# Altium schematic sheet HPS_IOs.SchDoc
size A1
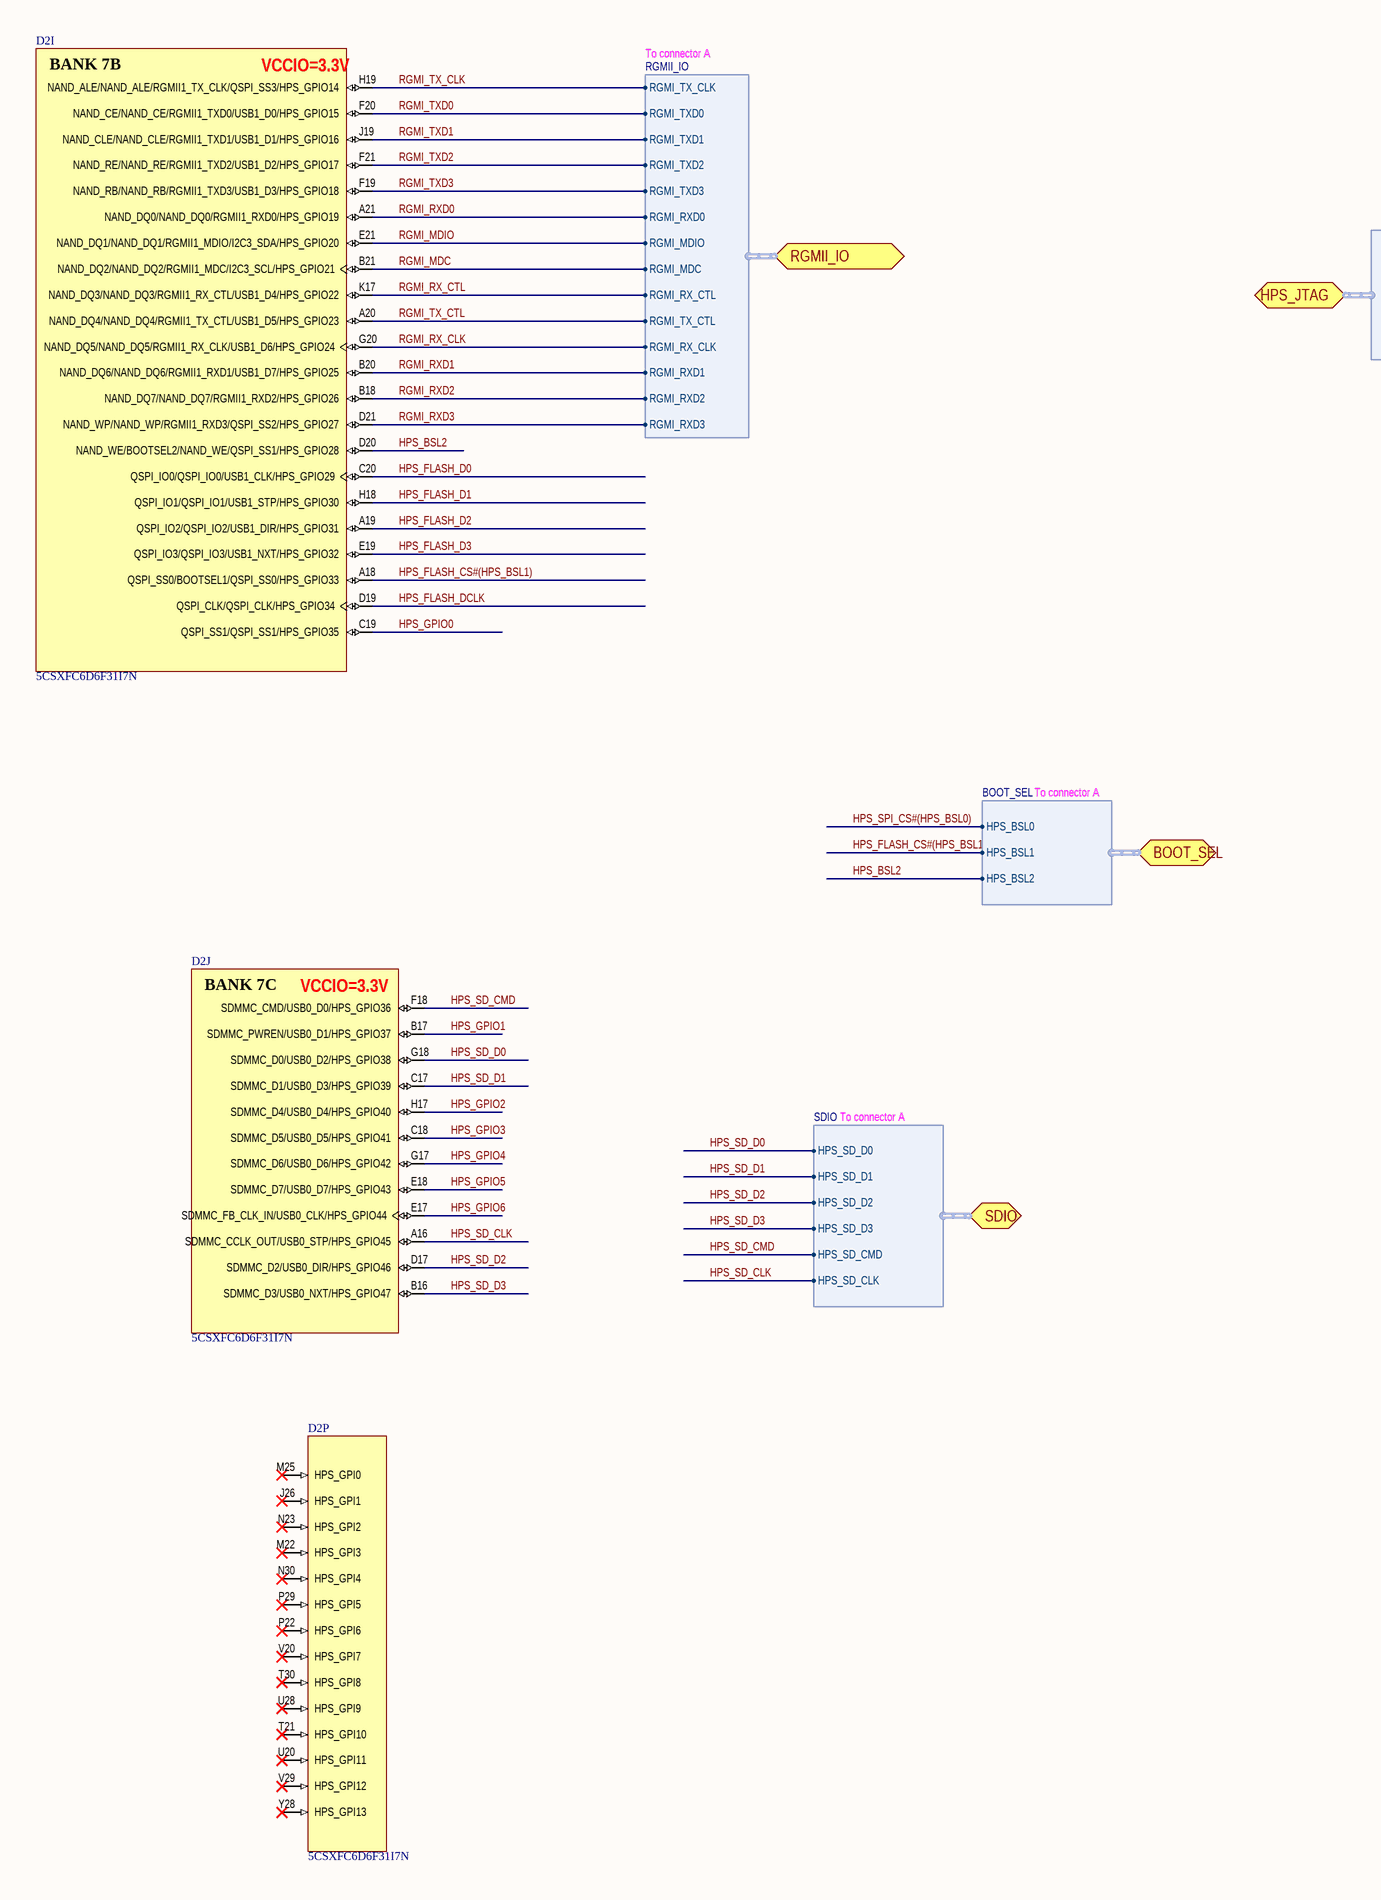
[diagram p0: HPS_IOs.SchDoc, left]
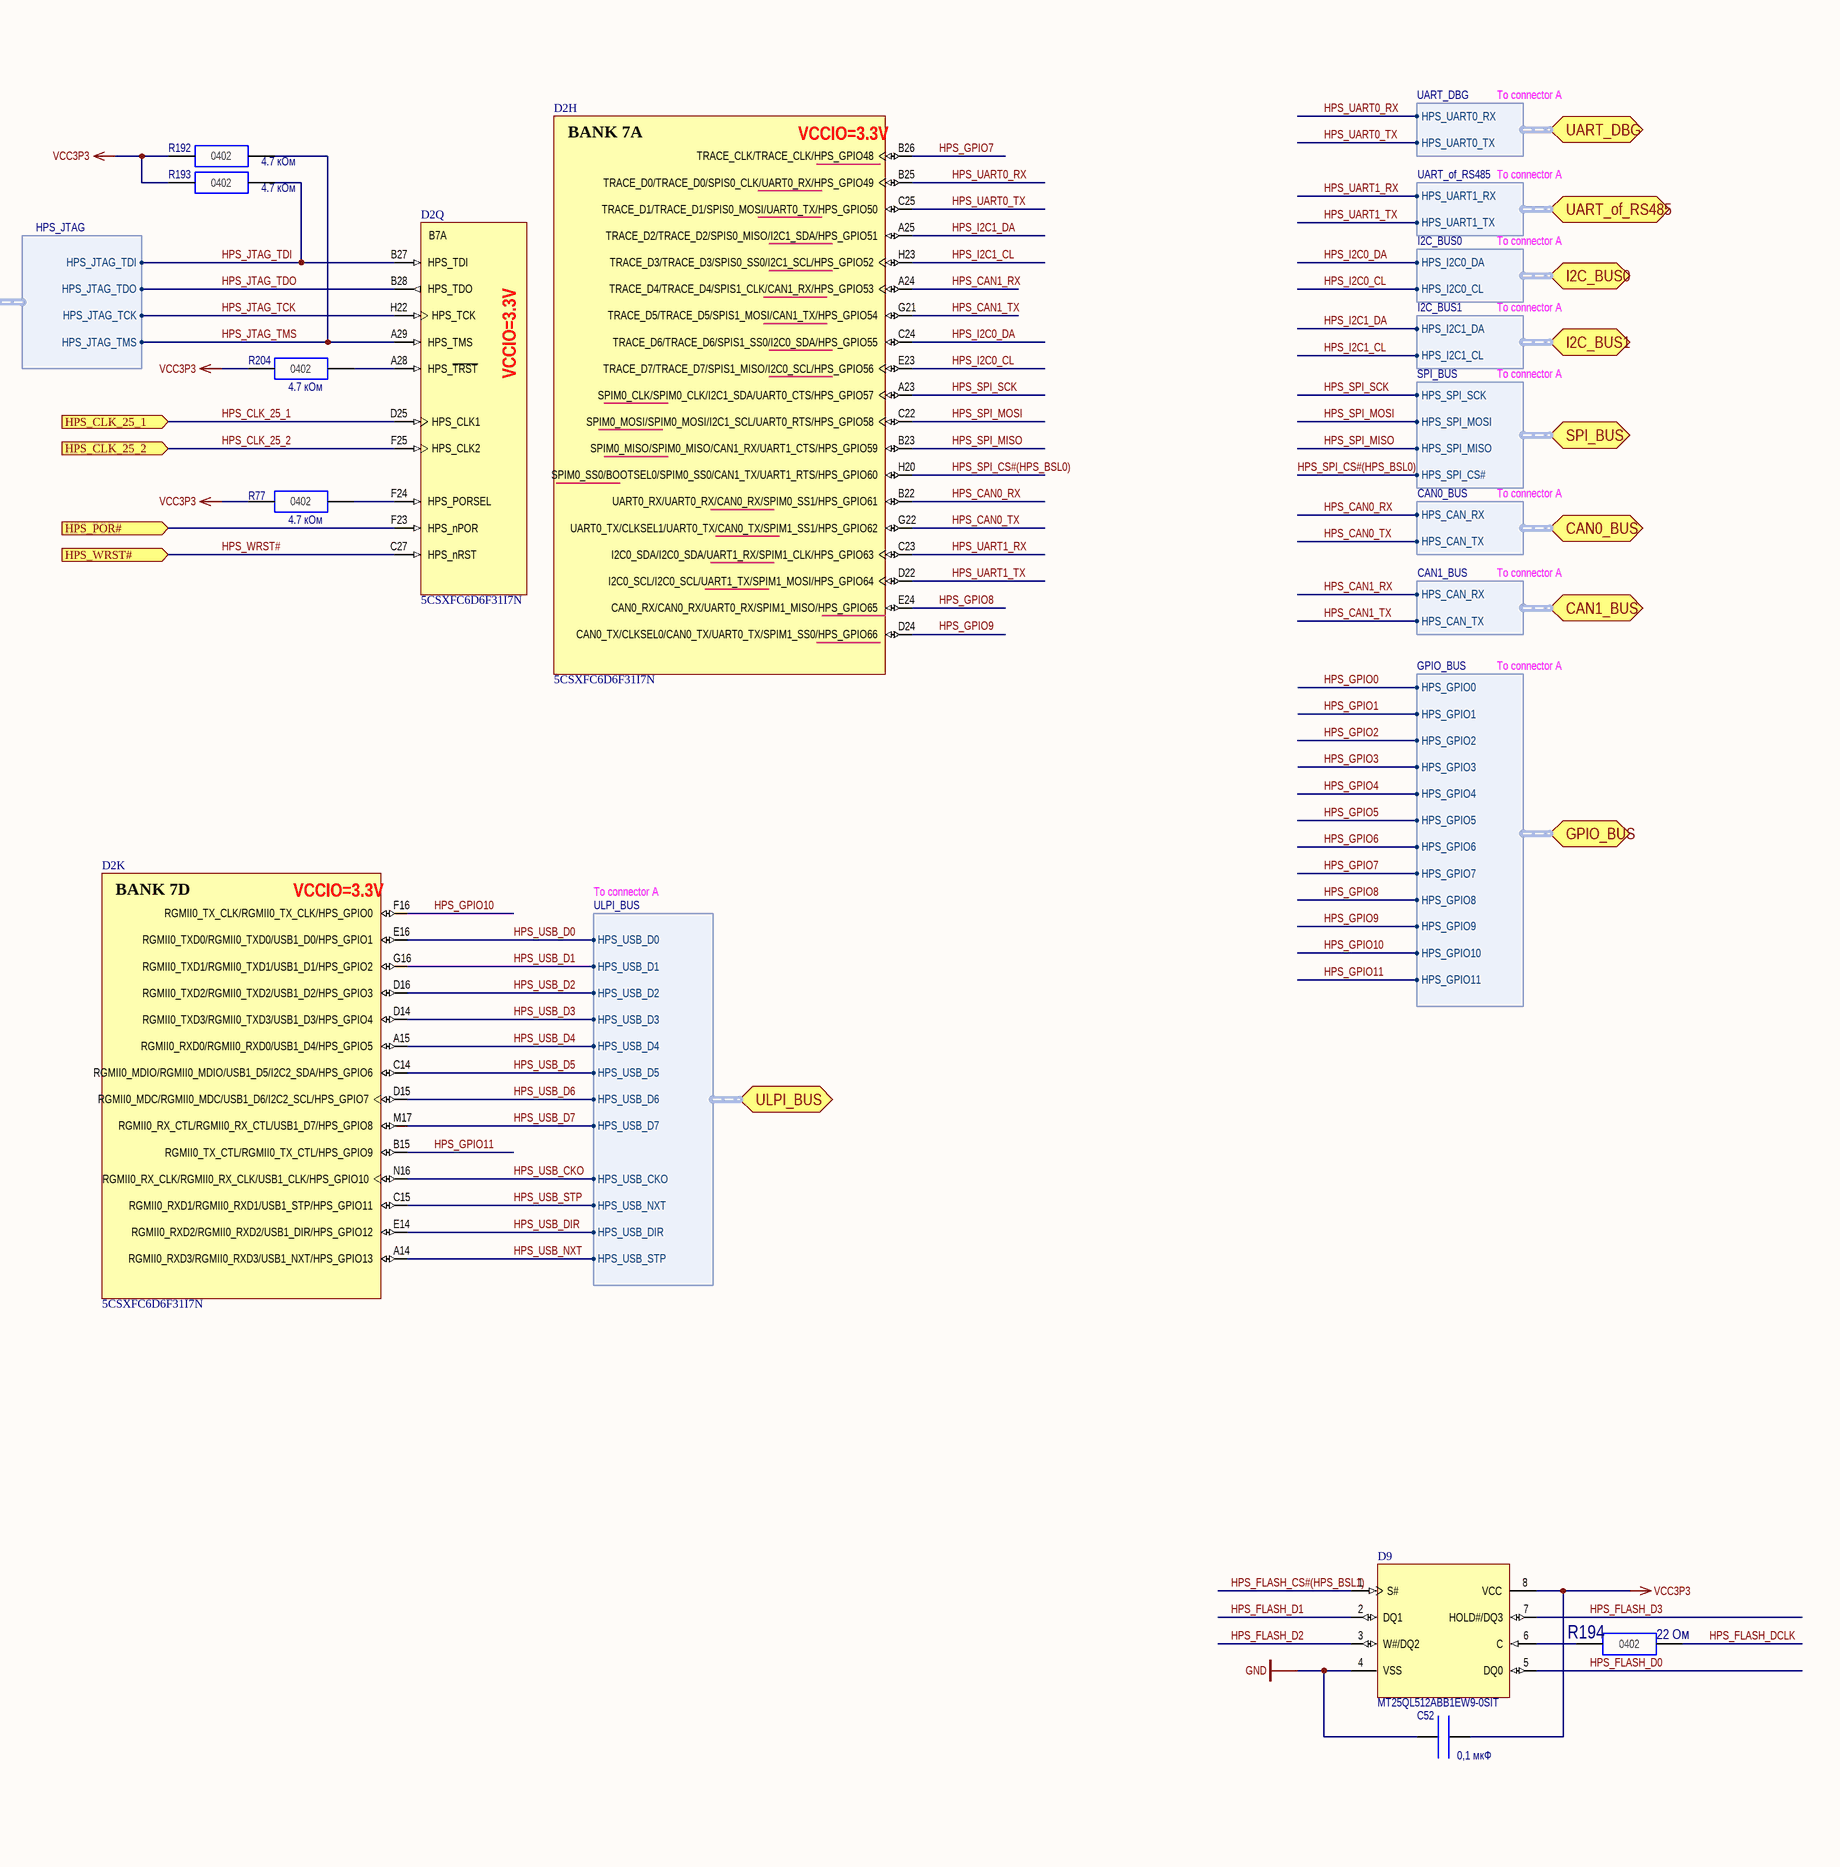
[diagram p1: HPS_IOs.SchDoc, right]

## Parts
C52  value 0,1 мкФ  [CC0402(1005)]  (hidden comment: CC0402-X7R-0,1 мкФ-20%-10В)
D2  5CSXFC6D6F31I7N  [ALTR-FBGA896_A-200]  (parts H,I,J,K,P,Q of 24)
D9  MT25QL512ABB1EW9-0SIT  [SON127P800X80_HS-9N]
R77  value 4.7 кОм  [CR0402(1005)]  (hidden comment: CR0402-4.7 кОм-±5%)
R192  value 4.7 кОм  [CR0402(1005)]  (hidden comment: CR0402-4.7 кОм-±5%)
R193  value 4.7 кОм  [CR0402(1005)]  (hidden comment: CR0402-4.7 кОм-±5%)
R194  value 22 Ом  [CR0402(1005)]  (hidden comment: CR0402-22 Ом-±5%)
R204  value 4.7 кОм  [CR0402(1005)]  (hidden comment: CR0402-4.7 кОм-±5%)

## Ports
BOOT_SEL (harness BOOT_SEL), CAN0_BUS (harness CAN0_BUS), CAN1_BUS (harness CAN1_BUS), GPIO_BUS (harness GPIO_BUS), HPS_CLK_25_1 (in), HPS_CLK_25_2 (in), HPS_JTAG (harness HPS_JTAG), HPS_POR# (in), HPS_WRST# (in), I2C_BUS0 (harness I2C_BUS0), I2C_BUS1 (harness I2C_BUS1), RGMII_IO (harness RGMII_IO), SDIO (harness SDIO), SPI_BUS (harness SPI_BUS), UART_DBG (harness UART_DBG), UART_of_RS485 (harness UART_of_RS485), ULPI_BUS (harness ULPI_BUS)

## Harnesses
HPS_JTAG: HPS_JTAG_TDI, HPS_JTAG_TDO, HPS_JTAG_TCK, HPS_JTAG_TMS
ULPI_BUS: HPS_USB_D0, HPS_USB_D1, HPS_USB_D2, HPS_USB_D3, HPS_USB_D4, HPS_USB_D5, HPS_USB_D6, HPS_USB_D7, HPS_USB_CKO, HPS_USB_NXT, HPS_USB_DIR, HPS_USB_STP
UART_DBG: HPS_UART0_RX, HPS_UART0_TX
UART_of_RS485: HPS_UART1_RX, HPS_UART1_TX
GPIO_BUS: HPS_GPIO0, HPS_GPIO1, HPS_GPIO2, HPS_GPIO3, HPS_GPIO4, HPS_GPIO5, HPS_GPIO6, HPS_GPIO7, HPS_GPIO8, HPS_GPIO9, HPS_GPIO10, HPS_GPIO11
SPI_BUS: HPS_SPI_MOSI, HPS_SPI_MISO, HPS_SPI_SCK, HPS_SPI_CS#
I2C_BUS0: HPS_I2C0_DA, HPS_I2C0_CL
I2C_BUS1: HPS_I2C1_DA, HPS_I2C1_CL
CAN0_BUS: HPS_CAN_TX, HPS_CAN_RX
SDIO: HPS_SD_D0, HPS_SD_D1, HPS_SD_D2, HPS_SD_D3, HPS_SD_CMD, HPS_SD_CLK
RGMII_IO: RGMI_TX_CLK, RGMI_TXD0, RGMI_TXD1, RGMI_TXD2, RGMI_TXD3, RGMI_RXD0, RGMI_RXD1, RGMI_RXD2, RGMI_RXD3, RGMI_TX_CTL, RGMI_RX_CTL, RGMI_RX_CLK, RGMI_MDIO, RGMI_MDC
BOOT_SEL: HPS_BSL0, HPS_BSL1, HPS_BSL2
CAN1_BUS: HPS_CAN_TX, HPS_CAN_RX

## Nets
GND: C52.1(+) D9.4(VSS)
VCC3P3: C52.2(-) D9.8(VCC) R77.1(+) R192.1(+) R193.1(+) R204.1(+)
HPS_BSL2: D2.D20(NAND_WE/BOOTSEL2/NAND_WE/QSPI_SS1/HPS_GPIO28) ; port BOOT_SEL.HPS_BSL2
HPS_CAN0_RX: D2.B22(UART0_RX/UART0_RX/CAN0_RX/SPIM0_SS1/HPS_GPIO61) ; port CAN0_BUS.HPS_CAN_RX
HPS_CAN0_TX: D2.G22(UART0_TX/CLKSEL1/UART0_TX/CAN0_TX/SPIM1_SS1/HPS_GPIO62) ; port CAN0_BUS.HPS_CAN_TX
HPS_CAN1_RX: D2.A24(TRACE_D4/TRACE_D4/SPIS1_CLK/CAN1_RX/HPS_GPIO53) ; port CAN1_BUS.HPS_CAN_RX
HPS_CAN1_TX: D2.G21(TRACE_D5/TRACE_D5/SPIS1_MOSI/CAN1_TX/HPS_GPIO54) ; port CAN1_BUS.HPS_CAN_TX
HPS_CLK_25_1: D2.D25(HPS_CLK1) ; port HPS_CLK_25_1
HPS_CLK_25_2: D2.F25(HPS_CLK2) ; port HPS_CLK_25_2
HPS_FLASH_CS#(HPS_BSL1): D2.A18(QSPI_SS0/BOOTSEL1/QSPI_SS0/HPS_GPIO33) D9.1(S#) ; port BOOT_SEL.HPS_BSL1
HPS_FLASH_D0: D2.C20(QSPI_IO0/QSPI_IO0/USB1_CLK/HPS_GPIO29) D9.5(DQ0)
HPS_FLASH_D1: D2.H18(QSPI_IO1/QSPI_IO1/USB1_STP/HPS_GPIO30) D9.2(DQ1)
HPS_FLASH_D2: D2.A19(QSPI_IO2/QSPI_IO2/USB1_DIR/HPS_GPIO31) D9.3(W#/DQ2)
HPS_FLASH_D3: D2.E19(QSPI_IO3/QSPI_IO3/USB1_NXT/HPS_GPIO32) D9.7(HOLD#/DQ3)
HPS_FLASH_DCLK: D2.D19(QSPI_CLK/QSPI_CLK/HPS_GPIO34) R194.2(-)
HPS_GPIO0: D2.C19(QSPI_SS1/QSPI_SS1/HPS_GPIO35) ; port GPIO_BUS.HPS_GPIO0
HPS_GPIO1: D2.B17(SDMMC_PWREN/USB0_D1/HPS_GPIO37) ; port GPIO_BUS.HPS_GPIO1
HPS_GPIO2: D2.H17(SDMMC_D4/USB0_D4/HPS_GPIO40) ; port GPIO_BUS.HPS_GPIO2
HPS_GPIO3: D2.C18(SDMMC_D5/USB0_D5/HPS_GPIO41) ; port GPIO_BUS.HPS_GPIO3
HPS_GPIO4: D2.G17(SDMMC_D6/USB0_D6/HPS_GPIO42) ; port GPIO_BUS.HPS_GPIO4
HPS_GPIO5: D2.E18(SDMMC_D7/USB0_D7/HPS_GPIO43) ; port GPIO_BUS.HPS_GPIO5
HPS_GPIO6: D2.E17(SDMMC_FB_CLK_IN/USB0_CLK/HPS_GPIO44) ; port GPIO_BUS.HPS_GPIO6
HPS_GPIO7: D2.B26(TRACE_CLK/TRACE_CLK/HPS_GPIO48) ; port GPIO_BUS.HPS_GPIO7
HPS_GPIO8: D2.E24(CAN0_RX/CAN0_RX/UART0_RX/SPIM1_MISO/HPS_GPIO65) ; port GPIO_BUS.HPS_GPIO8
HPS_GPIO9: D2.D24(CAN0_TX/CLKSEL0/CAN0_TX/UART0_TX/SPIM1_SS0/HPS_GPIO66) ; port GPIO_BUS.HPS_GPIO9
HPS_GPIO10: D2.F16(RGMII0_TX_CLK/RGMII0_TX_CLK/HPS_GPIO0) ; port GPIO_BUS.HPS_GPIO10
HPS_GPIO11: D2.B15(RGMII0_TX_CTL/RGMII0_TX_CTL/HPS_GPIO9) ; port GPIO_BUS.HPS_GPIO11
HPS_I2C0_CL: D2.E23(TRACE_D7/TRACE_D7/SPIS1_MISO/I2C0_SCL/HPS_GPIO56) ; port I2C_BUS0.HPS_I2C0_CL
HPS_I2C0_DA: D2.C24(TRACE_D6/TRACE_D6/SPIS1_SS0/I2C0_SDA/HPS_GPIO55) ; port I2C_BUS0.HPS_I2C0_DA
HPS_I2C1_CL: D2.H23(TRACE_D3/TRACE_D3/SPIS0_SS0/I2C1_SCL/HPS_GPIO52) ; port I2C_BUS1.HPS_I2C1_CL
HPS_I2C1_DA: D2.A25(TRACE_D2/TRACE_D2/SPIS0_MISO/I2C1_SDA/HPS_GPIO51) ; port I2C_BUS1.HPS_I2C1_DA
HPS_JTAG_TCK: D2.H22(HPS_TCK) ; port HPS_JTAG.HPS_JTAG_TCK
HPS_JTAG_TDI: D2.B27(HPS_TDI) R193.2(-) ; port HPS_JTAG.HPS_JTAG_TDI
HPS_JTAG_TDO: D2.B28(HPS_TDO) ; port HPS_JTAG.HPS_JTAG_TDO
HPS_JTAG_TMS: D2.A29(HPS_TMS) R192.2(-) ; port HPS_JTAG.HPS_JTAG_TMS
HPS_POR#: D2.F23(HPS_nPOR) ; port HPS_POR#
HPS_SD_CLK: D2.A16(SDMMC_CCLK_OUT/USB0_STP/HPS_GPIO45) ; port SDIO.HPS_SD_CLK
HPS_SD_CMD: D2.F18(SDMMC_CMD/USB0_D0/HPS_GPIO36) ; port SDIO.HPS_SD_CMD
HPS_SD_D0: D2.G18(SDMMC_D0/USB0_D2/HPS_GPIO38) ; port SDIO.HPS_SD_D0
HPS_SD_D1: D2.C17(SDMMC_D1/USB0_D3/HPS_GPIO39) ; port SDIO.HPS_SD_D1
HPS_SD_D2: D2.D17(SDMMC_D2/USB0_DIR/HPS_GPIO46) ; port SDIO.HPS_SD_D2
HPS_SD_D3: D2.B16(SDMMC_D3/USB0_NXT/HPS_GPIO47) ; port SDIO.HPS_SD_D3
HPS_SPI_CS#(HPS_BSL0): D2.H20(SPIM0_SS0/BOOTSEL0/SPIM0_SS0/CAN1_TX/UART1_RTS/HPS_GPIO60) ; port SPI_BUS.HPS_SPI_CS#, port BOOT_SEL.HPS_BSL0
HPS_SPI_MISO: D2.B23(SPIM0_MISO/SPIM0_MISO/CAN1_RX/UART1_CTS/HPS_GPIO59) ; port SPI_BUS.HPS_SPI_MISO
HPS_SPI_MOSI: D2.C22(SPIM0_MOSI/SPIM0_MOSI/I2C1_SCL/UART0_RTS/HPS_GPIO58) ; port SPI_BUS.HPS_SPI_MOSI
HPS_SPI_SCK: D2.A23(SPIM0_CLK/SPIM0_CLK/I2C1_SDA/UART0_CTS/HPS_GPIO57) ; port SPI_BUS.HPS_SPI_SCK
HPS_UART0_RX: D2.B25(TRACE_D0/TRACE_D0/SPIS0_CLK/UART0_RX/HPS_GPIO49) ; port UART_DBG.HPS_UART0_RX
HPS_UART0_TX: D2.C25(TRACE_D1/TRACE_D1/SPIS0_MOSI/UART0_TX/HPS_GPIO50) ; port UART_DBG.HPS_UART0_TX
HPS_UART1_RX: D2.C23(I2C0_SDA/I2C0_SDA/UART1_RX/SPIM1_CLK/HPS_GPIO63) ; port UART_of_RS485.HPS_UART1_RX
HPS_UART1_TX: D2.D22(I2C0_SCL/I2C0_SCL/UART1_TX/SPIM1_MOSI/HPS_GPIO64) ; port UART_of_RS485.HPS_UART1_TX
HPS_USB_CKO: D2.N16(RGMII0_RX_CLK/RGMII0_RX_CLK/USB1_CLK/HPS_GPIO10) ; port ULPI_BUS.HPS_USB_CKO
HPS_USB_D0: D2.E16(RGMII0_TXD0/RGMII0_TXD0/USB1_D0/HPS_GPIO1) ; port ULPI_BUS.HPS_USB_D0
HPS_USB_D1: D2.G16(RGMII0_TXD1/RGMII0_TXD1/USB1_D1/HPS_GPIO2) ; port ULPI_BUS.HPS_USB_D1
HPS_USB_D2: D2.D16(RGMII0_TXD2/RGMII0_TXD2/USB1_D2/HPS_GPIO3) ; port ULPI_BUS.HPS_USB_D2
HPS_USB_D3: D2.D14(RGMII0_TXD3/RGMII0_TXD3/USB1_D3/HPS_GPIO4) ; port ULPI_BUS.HPS_USB_D3
HPS_USB_D4: D2.A15(RGMII0_RXD0/RGMII0_RXD0/USB1_D4/HPS_GPIO5) ; port ULPI_BUS.HPS_USB_D4
HPS_USB_D5: D2.C14(RGMII0_MDIO/RGMII0_MDIO/USB1_D5/I2C2_SDA/HPS_GPIO6) ; port ULPI_BUS.HPS_USB_D5
HPS_USB_D6: D2.D15(RGMII0_MDC/RGMII0_MDC/USB1_D6/I2C2_SCL/HPS_GPIO7) ; port ULPI_BUS.HPS_USB_D6
HPS_USB_D7: D2.M17(RGMII0_RX_CTL/RGMII0_RX_CTL/USB1_D7/HPS_GPIO8) ; port ULPI_BUS.HPS_USB_D7
HPS_USB_DIR: D2.E14(RGMII0_RXD2/RGMII0_RXD2/USB1_DIR/HPS_GPIO12) ; port ULPI_BUS.HPS_USB_DIR
HPS_USB_NXT: D2.A14(RGMII0_RXD3/RGMII0_RXD3/USB1_NXT/HPS_GPIO13) ; port ULPI_BUS.HPS_USB_STP
HPS_USB_STP: D2.C15(RGMII0_RXD1/RGMII0_RXD1/USB1_STP/HPS_GPIO11) ; port ULPI_BUS.HPS_USB_NXT
HPS_WRST#: D2.C27(HPS_nRST) ; port HPS_WRST#
RGMI_MDC: D2.B21(NAND_DQ2/NAND_DQ2/RGMII1_MDC/I2C3_SCL/HPS_GPIO21) ; port RGMII_IO.RGMI_MDC
RGMI_MDIO: D2.E21(NAND_DQ1/NAND_DQ1/RGMII1_MDIO/I2C3_SDA/HPS_GPIO20) ; port RGMII_IO.RGMI_MDIO
RGMI_RX_CLK: D2.G20(NAND_DQ5/NAND_DQ5/RGMII1_RX_CLK/USB1_D6/HPS_GPIO24) ; port RGMII_IO.RGMI_RX_CLK
RGMI_RX_CTL: D2.K17(NAND_DQ3/NAND_DQ3/RGMII1_RX_CTL/USB1_D4/HPS_GPIO22) ; port RGMII_IO.RGMI_RX_CTL
RGMI_RXD0: D2.A21(NAND_DQ0/NAND_DQ0/RGMII1_RXD0/HPS_GPIO19) ; port RGMII_IO.RGMI_RXD0
RGMI_RXD1: D2.B20(NAND_DQ6/NAND_DQ6/RGMII1_RXD1/USB1_D7/HPS_GPIO25) ; port RGMII_IO.RGMI_RXD1
RGMI_RXD2: D2.B18(NAND_DQ7/NAND_DQ7/RGMII1_RXD2/HPS_GPIO26) ; port RGMII_IO.RGMI_RXD2
RGMI_RXD3: D2.D21(NAND_WP/NAND_WP/RGMII1_RXD3/QSPI_SS2/HPS_GPIO27) ; port RGMII_IO.RGMI_RXD3
RGMI_TX_CLK: D2.H19(NAND_ALE/NAND_ALE/RGMII1_TX_CLK/QSPI_SS3/HPS_GPIO14) ; port RGMII_IO.RGMI_TX_CLK
RGMI_TX_CTL: D2.A20(NAND_DQ4/NAND_DQ4/RGMII1_TX_CTL/USB1_D5/HPS_GPIO23) ; port RGMII_IO.RGMI_TX_CTL
RGMI_TXD0: D2.F20(NAND_CE/NAND_CE/RGMII1_TXD0/USB1_D0/HPS_GPIO15) ; port RGMII_IO.RGMI_TXD0
RGMI_TXD1: D2.J19(NAND_CLE/NAND_CLE/RGMII1_TXD1/USB1_D1/HPS_GPIO16) ; port RGMII_IO.RGMI_TXD1
RGMI_TXD2: D2.F21(NAND_RE/NAND_RE/RGMII1_TXD2/USB1_D2/HPS_GPIO17) ; port RGMII_IO.RGMI_TXD2
RGMI_TXD3: D2.F19(NAND_RB/NAND_RB/RGMII1_TXD3/USB1_D3/HPS_GPIO18) ; port RGMII_IO.RGMI_TXD3
NetD2_A28: D2.A28(HPS_~{TRST}) R204.2(-)
NetD2_F24: D2.F24(HPS_PORSEL) R77.2(-)
NetD9_6: D9.6(C) R194.1(+)

Not connected (* = marked no-connect by the designer): D2 J26(HPS_GPI1)* M22(HPS_GPI3)* M25(HPS_GPI0)* N23(HPS_GPI2)* N30(HPS_GPI4)* P22(HPS_GPI6)* P29(HPS_GPI5)* T21(HPS_GPI10)* T30(HPS_GPI8)* U20(HPS_GPI11)* U28(HPS_GPI9)* V20(HPS_GPI7)* V29(HPS_GPI12)* Y28(HPS_GPI13)*

## Notes on the sheet
- (near D2) VCCIO=3.3V
- To connector A
- (near D2) B7A
- VCCIO=3.3V
- (in symbol 5CSXFC6D6F31I7N, part H) BANK 7A
- (in symbol 5CSXFC6D6F31I7N, part I) BANK 7B
- (in symbol 5CSXFC6D6F31I7N, part J) BANK 7C
- (in symbol 5CSXFC6D6F31I7N, part K) BANK 7D
- (in symbol CR0402-#-±5%) 0402

## Library data of the parts
C52 = CC0402-X7R-#-20%-10В: Чип конденсатор керамический; Supplier 1: Digi-Key; Supplier Part Number 1: 399-3520-1-ND
D2 = 5CSXFC6D6F31I7N: Cyclone V SX Family FPGA, 1.07 to 1.13 V Supply, 288 I/O Pins, 6 PLLs, 896-Pin FBGA, Speed Grade 7, Industrial Grade, RoHS Compliant; Manufacturer: Altera; Logic Elements (LE) (K): 110; Speed Grade: 7; DatasheetVersion: Rev. 3.4; PackageVersion: Rev. 2.0, 12/2012; PackageReference: FBGA896_A-200; PackageDescription: 896-Pin FineLine Ball-Grid Array (FBGA), Body 31 x 31 mm, Pitch 1 mm; Supplier 1: Digi-Key; Supplier Part Number 1: 5CSXFC6D6F31I7N-ND; Supplier 2: Mouser; Supplier Part Number 2: 989-5CSXFC6D6F31I7N; Device Group: 5CSXFC6; RoHS: RoHS Compliant; Subcategory: Cyclone V SX; Voltage Supply: 1.07 to 1.13 V; NexusDeviceID: 5CSXFC6D6F31I7N; Mounting Technology: Surface Mount; Code_JEDEC: MS-034; PartNumber: 5CSXFC6D6F31I7N; ComponentLink1Description: Manufacturer URL; ComponentLink1URL: http://www.altera.com; ComponentLink2Description: Datasheet; ComponentLink2URL: http://www.altera.com/literature/hb/cyclone-v/cv_51002.pdf; ComponentLink3Description: Package Specification; ComponentLink3URL: http://www.altera.com/devicepackaging/04R00435-01.pdf; ComponentLink4Description: Device Handbook URL; ComponentLink4URL: http://www.altera.com/literature/hb/cyclone-v/cyclone5_handbook.pdf; ComponentLink5Description: Device Pin-Out URL; ComponentLink5URL: http://www.altera.com/literature/dp/cyclone-v/5CSXFC6.xls; ComponentLink6Description: Product URL; ComponentLink6URL: http://www.buyaltera.com/scripts/partsearch.dll?Detail&name=5CSXFC6D6F31I7N-ND
D9 = MT25QL512ABB1EW9-0SIT: 512 Mb (x1/x2/x4) Serial NOR Flash Memory with Multi I/O, 108 MHz, 2.7 to 3.6 V, 16-pin SO16 Wide (SF), Tape & Reel; Part Family: MT25Q; Manufacturer: Micron; Density: 512Mb; Speed: 133 MHz; Voltage: 2.7V-3.6V; DatasheetVersion: Rev. J; PackageReference: 8-WDFN; PackageDescription: 8-WPDFN (6x8) (MLP8); Applications: Embedded; Package: 8-WDFN Exposed Pad; Part Status: Production; RoHS: Yes; Type: Multi I/O; Width: x1/x2/x4; Mounting Technology: Surface Mount; PartNumber: MT25QL512ABB1EW9-0SIT; ComponentLink1Description: Manufacturer URL; ComponentLink1URL: http://www.micron.com/; ComponentLink2Description: Datasheet; ComponentLink2URL: https://www.micron.com/~/media/documents/products/data-sheet/nor-flash/serial-nor/mt25q/die-rev-b/mt25q_qlkt_l_512_abb_0.pdf; ComponentLink3Description: Package Specification; ComponentLink3URL: https://www.micron.com/~/media/documents/products/data-sheet/nor-flash/serial-nor/mt25q/die-rev-b/mt25q_qlkt_l_512_abb_0.pdf
R77 R192-R194 R204 = CR0402-#-±5%: Чип резистор; Maximum Working Voltage: 50 В; TOLERANCE: 5%; Supplier 1: Digi-Key
  R77 R192 R193 R204: Supplier Part Number 1: 311-4.7KJRTR-ND
  R194: Supplier Part Number 1: 311-10.0KLRDKR-ND